# Altium schematic sheet Ethernet.SchDoc
size A3
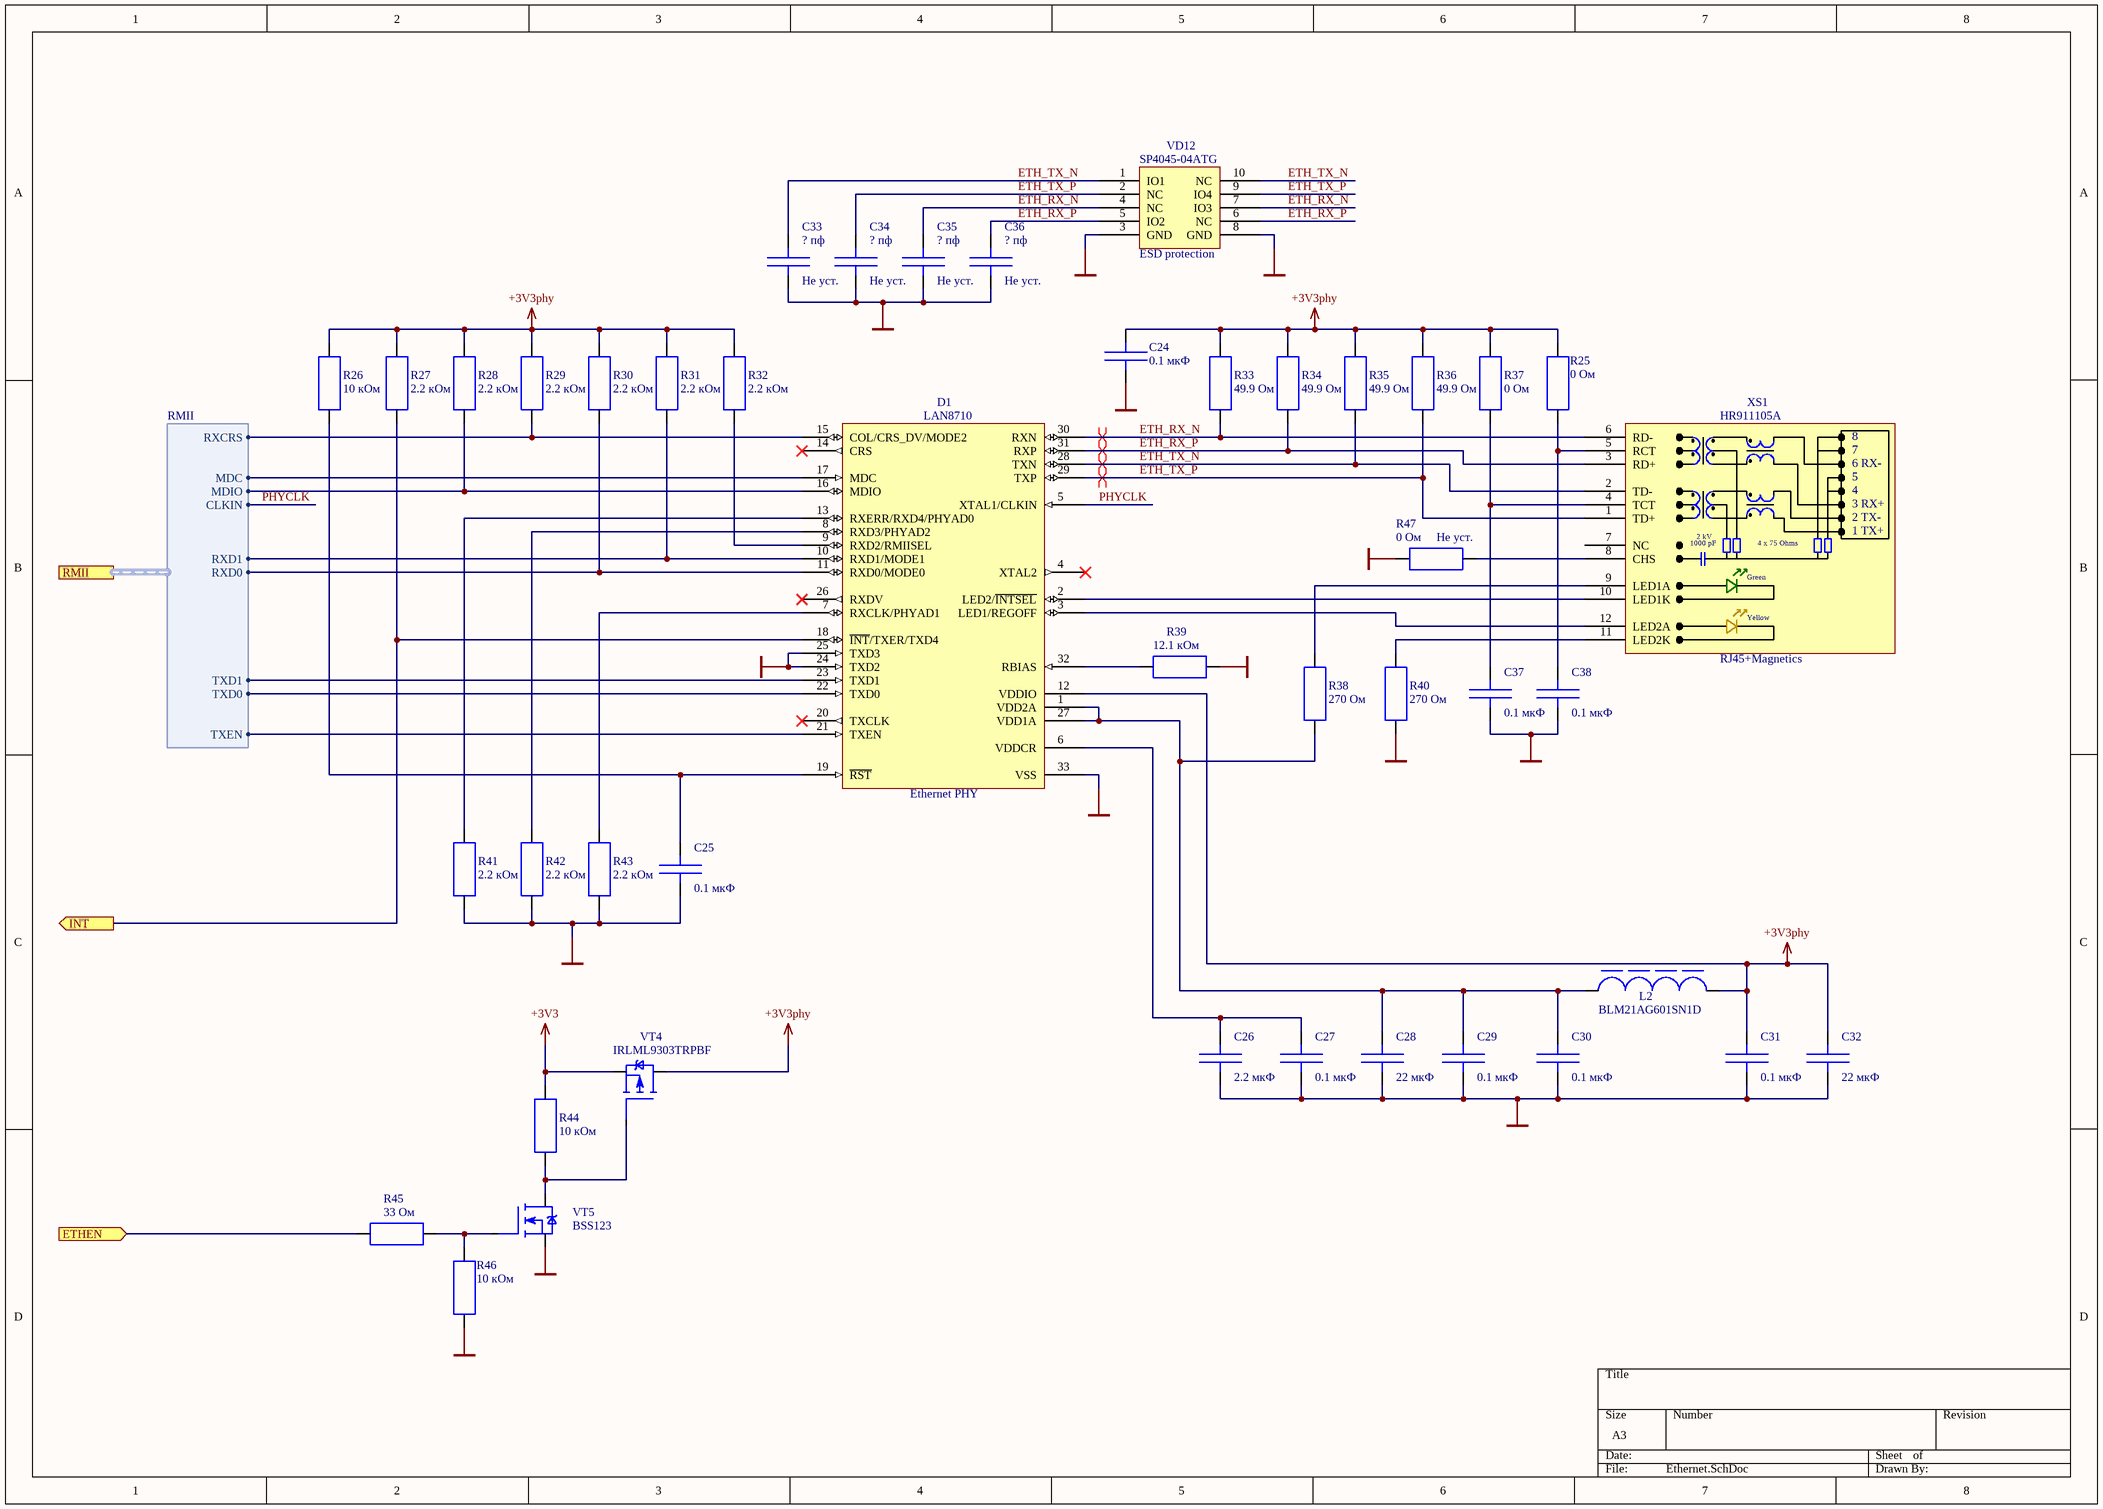
[diagram p0: Ethernet.SchDoc]

## Parts
C24  value 0.1 мкФ  [CAP_0603-1608]  (hidden comment: Cap)
C25  value 0.1 мкФ  [CAP_0603-1608]  (hidden comment: Cap)
C26  value 2.2 мкФ  [CAP_0603-1608]  (hidden comment: Cap)
C27  value 0.1 мкФ  [CAP_0603-1608]  (hidden comment: Cap)
C28  value 22 мкФ  [CAP_0805-2012]  (hidden comment: Cap)
C29  value 0.1 мкФ  [CAP_0603-1608]  (hidden comment: Cap)
C30  value 0.1 мкФ  [CAP_0603-1608]  (hidden comment: Cap)
C31  value 0.1 мкФ  [CAP_0603-1608]  (hidden comment: Cap)
C32  value 22 мкФ  [CAP_0805-2012]  (hidden comment: Cap)
C33  Не уст.  value ? пф  [CAP_0603-1608]  (no BOM)
C34  Не уст.  value ? пф  [CAP_0603-1608]  (no BOM)
C35  Не уст.  value ? пф  [CAP_0603-1608]  (no BOM)
C36  Не уст.  value ? пф  [CAP_0603-1608]  (no BOM)
C37  value 0.1 мкФ  [CAP_0603-1608]  (hidden comment: Cap)
C38  value 0.1 мкФ  [CAP_0603-1608]  (hidden comment: Cap)
D1  Ethernet PHY  [QFN-0.5-32]
L2  Type: BLM21AG601SN1D  [CAP_0805-2012]  (hidden comment: Inductor_Ferrite)
R25  value 0 Ом  [RES_0603-1608]  (hidden comment: Res)
R26  value 10 кОм  [RES_0603-1608]  (hidden comment: Res)
R27  value 2.2 кОм  [RES_0603-1608]  (hidden comment: Res)
R28  value 2.2 кОм  [RES_0603-1608]  (hidden comment: Res)
R29  value 2.2 кОм  [RES_0603-1608]  (hidden comment: Res)
R30  value 2.2 кОм  [RES_0603-1608]  (hidden comment: Res)
R31  value 2.2 кОм  [RES_0603-1608]  (hidden comment: Res)
R32  value 2.2 кОм  [RES_0603-1608]  (hidden comment: Res)
R33  value 49.9 Ом  [RES_0603-1608]  (hidden comment: Res)
R34  value 49.9 Ом  [RES_0603-1608]  (hidden comment: Res)
R35  value 49.9 Ом  [RES_0603-1608]  (hidden comment: Res)
R36  value 49.9 Ом  [RES_0603-1608]  (hidden comment: Res)
R37  value 0 Ом  [RES_0603-1608]  (hidden comment: Res)
R38  value 270 Ом  [RES_0603-1608]  (hidden comment: Res)
R39  value 12.1 кОм  [RES_0603-1608]  (hidden comment: Res)
R40  value 270 Ом  [RES_0603-1608]  (hidden comment: Res)
R41  value 2.2 кОм  [RES_0603-1608]  (hidden comment: Res)
R42  value 2.2 кОм  [RES_0603-1608]  (hidden comment: Res)
R43  value 2.2 кОм  [RES_0603-1608]  (hidden comment: Res)
R44  value 10 кОм  [RES_0603-1608]  (hidden comment: Res)
R45  value 33 Ом  [RES_0603-1608]  (hidden comment: Res)
R46  value 10 кОм  [RES_0603-1608]  (hidden comment: Res)
R47  Не уст.  value 0 Ом  [RES_0603-1608]  (no BOM)
VD12  ESD protection  [MSOP-0.5-10]
VT4  Type: IRLML9303TRPBF  [SOT-23-3]  (hidden comment: Transistor_P-MOSFET_Enh_Bulk_Shot)
VT5  Type: BSS123  [SOT-23-3]  (hidden comment: Transistor_N-MOSFET_Enh_Bulk_Shot)
XS1  RJ45+Magnetics  [HR911105A]

## Ports
ETHEN (in), INT (out), RMII (harness RMII)

## Harnesses
RMII: CLKIN, MDC, MDIO, RXCRS, RXD0, RXD1, TXD0, TXD1, TXEN

## Nets
+3V3: R44.1 VT4.2(S)
+3V3phy: C24.1 C31.2 C32.2 D1.12(VDDIO) L2.2 R25.1 R26.2 R27.2 R28.2 R29.2 R30.2 R31.2 R32.2 R33.2 R34.2 R35.2 R36.2 R37.2 VT4.3(D)
GND: C24.2 C25.1 C26.1 C27.1 C28.1 C29.1 C30.1 C31.1 C32.1 C33.2 C34.2 C35.2 C36.2 C37.2 C38.2 D1.24(TXD2) D1.25(TXD3) D1.33(VSS) R39.2 R40.1 R41.2 R42.2 R43.2 R46.2 R47.1 VD12.3(GND) VD12.8(GND) VT5.2(S)
ETH_RX_N: C35.1 D1.30(RXN) R33.1 VD12.4(NC) VD12.7(IO3) XS1.6(RD-)
ETH_RX_P: C36.1 D1.31(RXP) R34.1 VD12.5(IO2) VD12.6(NC) XS1.3(RD+)
ETH_TX_N: C33.1 D1.28(TXN) R35.1 VD12.1(IO1) VD12.10(NC) XS1.2(TD-)
ETH_TX_P: C34.1 D1.29(TXP) R36.1 VD12.2(NC) VD12.9(IO4) XS1.1(TD+)
ETHEN: R45.2 ; port ETHEN
INT: D1.18(~{INT}/TXER/TXD4) R27.1 ; port INT
PHYCLK: D1.5(XTAL1/CLKIN) ; port RMII.CLKIN
NetC25_2: C25.2 D1.19(~{RST}) R26.1
NetC26_2: C26.2 C27.2 D1.6(VDDCR)
NetC28_2: C28.2 C29.2 C30.2 D1.1(VDD2A) D1.27(VDD1A) L2.1 R38.2
NetC37_1: C37.1 R37.1 XS1.4(TCT)
NetC38_1: C38.1 R25.2 XS1.5(RCT)
NetD1_2: D1.2(LED2/~{INTSEL}) XS1.10(LED1K)
NetD1_3: D1.3(LED1/REGOFF) XS1.12(LED2A)
NetD1_7: D1.7(RXCLK/PHYAD1) R43.1
NetD1_8: D1.8(RXD3/PHYAD2) R42.1
NetD1_9: D1.9(RXD2/RMIISEL) R32.1
NetD1_10: D1.10(RXD1/MODE1) R31.1 ; port RMII.RXD1
NetD1_11: D1.11(RXD0/MODE0) R30.1 ; port RMII.RXD0
NetD1_13: D1.13(RXERR/RXD4/PHYAD0) R41.1
NetD1_15: D1.15(COL/CRS_DV/MODE2) R29.1 ; port RMII.RXCRS
NetD1_16: D1.16(MDIO) R28.1 ; port RMII.MDIO
NetD1_17: D1.17(MDC) ; port RMII.MDC
NetD1_21: D1.21(TXEN) ; port RMII.TXEN
NetD1_22: D1.22(TXD0) ; port RMII.TXD0
NetD1_23: D1.23(TXD1) ; port RMII.TXD1
NetD1_32: D1.32(RBIAS) R39.1
NetR38_1: R38.1 XS1.9(LED1A)
NetR40_2: R40.2 XS1.11(LED2K)
NetR44_2: R44.2 VT4.1(G) VT5.3(D)
NetR45_1: R45.1 R46.1 VT5.1(G)
NetR47_2: R47.2 XS1.8(CHS)

Not connected (* = marked no-connect by the designer): D1 4(XTAL2)* 14(CRS)* 20(TXCLK)* 26(RXDV)*; XS1 7(NC)

## Layout directives
differential pair: ETH_RX_N, ETH_RX_P, ETH_TX_N, ETH_TX_P

## Notes on the sheet
- (in symbol HR911105A) 6 RX-; 3 RX+; 2 TX-; 1 TX+; 1000 pF; 2 kV; 4 x 75 Ohms; Green; Yellow

## Library data of the parts
C24 C25 C27 C29-C31 C33-C38 = Cap: Конденсатор; Voltage: 50 В; Type: GRM188R71H104K; Dielectric: X7R; BomGroup: Конденсаторы; BomTitle: Конденсатор керамический SMD; Case: 0603
C26 = Cap: Конденсатор; Voltage: 10 В; Type: GRM188R61A225K; Dielectric: X5R; BomGroup: Конденсаторы; BomTitle: Конденсатор керамический SMD; Case: 0603
C28 C32 = Cap: Конденсатор; Voltage: 6.3 В; Type: GRM21BR60J226M; Dielectric: X5R; BomGroup: Конденсаторы; BomTitle: Конденсатор керамический SMD; Case: 0805
D1 = LAN8710: 10/100 Ethernet MII/RMII Transceiver; BomGroup: Микросхемы; BomTitle: Микросхема; Type: LAN8710
L2 = Inductor_Ferrite: Катушка идуктивности с магнитодиэлектрическим магнитопроводом; BomGroup: Индуктивности; BomTitle: Дроссель подавления ЭМП; Case: 0805
R25-R43 R47 = Res: Резистор постоянный; Power: 0.125 W; Tolerance: 5%; BomGroup: Резисторы; BomTitle: Резистор SMD; Case: 0603
R44-R46 = Res: ЧИП резистор постоянный; Power: 0.1 W; Tolerance: 5%; BomGroup: Резисторы; BomTitle: Резистор SMD; Case: 0603
VD12 = SP4045-04ATG: 1.5pF 24A Diode Array; BomGroup: Микросхемы; BomItemTitle: Супрессор; BomTitle: Микросхема; Type: SP4045-04ATG
VT4 = Transistor_P-MOSFET_Enh_Bulk_Shot: P-канальный полевой транзистор с изолированным затвором обогащенного типа с соединением истока и подложки c диодом Шоттки; BomGroup: Транзисторы; BomTitle: Транзистор P-канальный; Case: SOT-23-3
VT5 = Transistor_N-MOSFET_Enh_Bulk_Shot: N-канальный полевой транзистор с изолированным затвором обогащенного типа с соединением истока и подложки с диодом Шоттки; BomGroup: Транзисторы; BomTitle: Транзистор N-канальный; Case: SOT-23-3
XS1 = HR911105A: RJ-45 socket with magnetics; BomGroup: Соединители; BomTitle: Розетка RJ-45 с трансформатором; Type: HR911105A